# Altium schematic sheet POWER_SUPPLY_20V_4A.SchDoc
size A1
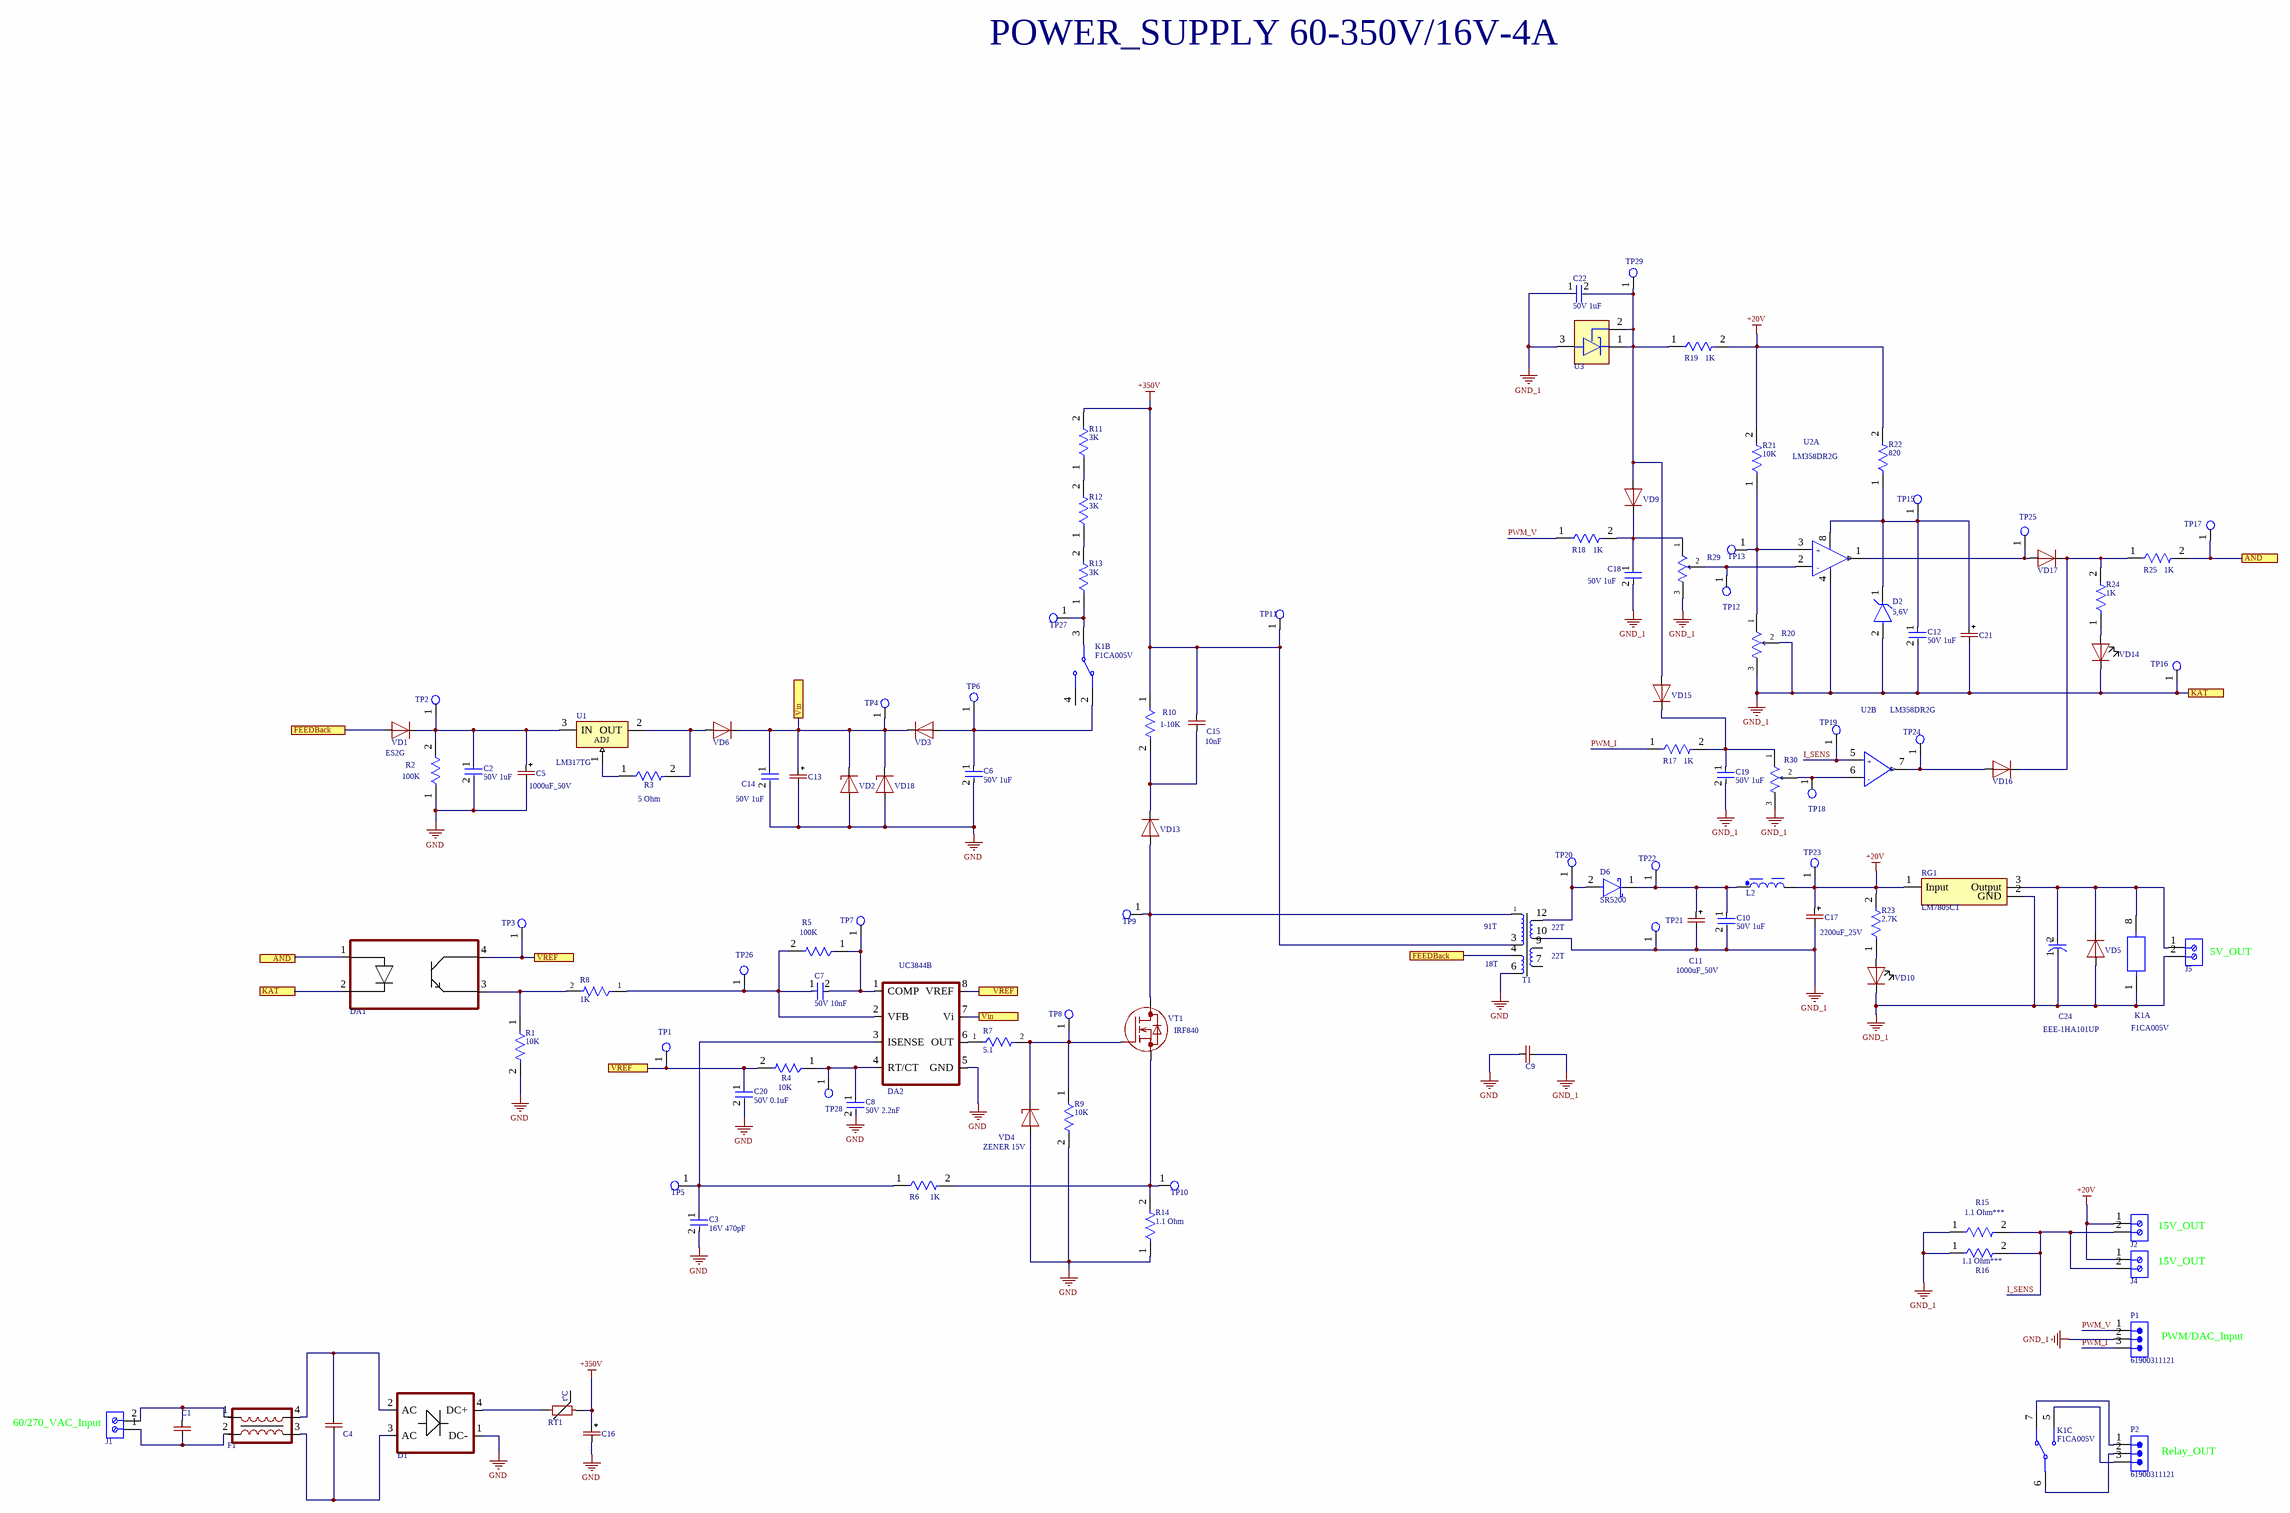
[diagram p0: POWER_SUPPLY_20V_4A.SchDoc]

## Parts
C1  CAP-NON-POLAR  [CAP-V15]  (value not drawn)
C2  50V 1uF  [FP-C0805C-DN-IPC_A]
C3  16V 470pF  [FP-C0805C-DN-IPC_A]
C4  CAP-NON-POLAR  [CAP-V15]  (value not drawn)
C5  1000uF_50V  [CAPPOL-12x25]
C6  50V 1uF  [FP-C0805C-DN-IPC_A]
C7  50V 10nF  [FP-C0805C-DN-IPC_A]
C8  50V 2.2nF  [FP-C0805C-DN-IPC_A]
C9  CAP-V  [CAP-V]  (value not drawn)
C10  50V 1uF  [FP-C0805C-DN-IPC_A]
C11  1000uF_50V  [CAPPOL-12x25]
C12  50V 1uF  [FP-C0805C-DN-IPC_A]
C13  CAP-POLAR  [CAPPOL-12x25]  (value not drawn)
C14  50V 1uF  [FP-C0805C-DN-IPC_A]
C15  10nF  [CAP-V]
C16  CAP-POLAR  [CAP 100uF_500V 22x40mm]  (value not drawn)
C17  2200uF_25V  [CAPPOL-12x25]
C18  50V 1uF  [FP-C0805C-DN-IPC_A]
C19  50V 1uF  [FP-C0805C-DN-IPC_A]
C20  50V 0.1uF  [FP-C0805C-DN-IPC_A]
C21  CAP-POLAR  [CAP-TAN-C]  (value not drawn)
C22  50V 1uF  [FP-C0805C-DN-IPC_A]
C24  EEE-1HA101UP  [FP-SF-MFG]
D1  RS40X  [RS40X]  (value not drawn)
D2  5,6V  [FP-SB-V-3906_04-031_4-MFG]
D6  SR5200  [SR5100(DO-201AD]
DA1  PC817  [4-SMD]  (value not drawn)
DA2  UC3844B  [SOIC8-150]
F1  FILTER  [FILTER_1]  (value not drawn)
J1  691101710002  [691101710002]  (value not drawn)
J2  (no value)  [691101710002]
J4  691101710002  [691101710002]  (value not drawn)
J5  691101710002  [691101710002]  (value not drawn)
K1  F1CA005V  [Relay_F1CA005V_Omron]  (parts A,B,C of 3)
L2  1.2µH, 7.4A  [WE-PD2_1054]  (value not drawn)
P1  61900311121  [61900311121]
P2  61900311121  [61900311121]
R1  10K  [RES-0805]
R2  100K  [RES-0805]
R3  5 Ohm  [RES-0805]
R4  10K  [RES-0805]
R5  100K  [RES-0805]
R6  1K  [RES-0805]
R7  5.1  [Vishay_CRCW0805-e3_IPC_A]
R8  1K  [Vishay_CRCW0805-e3_IPC_A]
R9  10K  [RES-0805]
R10  1-10K  [RES-2512]
R11  3K  [RES-2512]
R12  3K  [RES-2512]
R13  3K  [RES-2512]
R14  1.1 Ohm  [RES-2W]
R15  1.1 Ohm***  [RES-2W_2]
R16  1.1 Ohm***  [RES-2W_2]
R17  1K  [RES-0805]
R18  1K  [RES-0805]
R19  1K  [RES-0805]
R20  3296W-1-202LF  [Bourns_3296W_MFG]  (value not drawn)
R21  10K  [RES-0805]
R22  820  [RES-0805]
R23  2.7K  [RES-0805]
R24  1K  [RES-0805]
R25  1K  [RES-0805]
R29  3296W-1-202LF  [Bourns_3296W_MFG]  (value not drawn)
R30  3296W-1-202LF  [Bourns_3296W_MFG]  (value not drawn)
RG1  LM7805CT  [TO-220_Bended_Rad]
RT1  RES-TEMP  [RES-V5]  (value not drawn)
T1  ETD29  [ETD29_Transformer]  (value not drawn)
TP1  Test_Point_PCB  [Test_Point]  (value not drawn)
TP2  Test_Point_PCB  [Test_Point]  (value not drawn)
TP3  Test_Point_PCB  [Test_Point]  (value not drawn)
TP4  Test_Point_PCB  [Test_Point]  (value not drawn)
TP5  Test_Point_PCB  [Test_Point]  (value not drawn)
TP6  Test_Point_PCB  [Test_Point]  (value not drawn)
TP7  Test_Point_PCB  [Test_Point]  (value not drawn)
TP8  Test_Point_PCB  [Test_Point]  (value not drawn)
TP9  Test_Point_PCB  [Test_Point]  (value not drawn)
TP10  Test_Point_PCB  [Test_Point]  (value not drawn)
TP11  Test_Point_PCB  [Test_Point]  (value not drawn)
TP12  Test_Point_PCB  [Test_Point]  (value not drawn)
TP13  Test_Point_PCB  [Test_Point]  (value not drawn)
TP15  Test_Point_PCB  [Test_Point]  (value not drawn)
TP16  Test_Point_PCB  [Test_Point]  (value not drawn)
TP17  Test_Point_PCB  [Test_Point]  (value not drawn)
TP18  Test_Point_PCB  [Test_Point]  (value not drawn)
TP19  Test_Point_PCB  [Test_Point]  (value not drawn)
TP20  Test_Point_PCB  [Test_Point]  (value not drawn)
TP21  Test_Point_PCB  [Test_Point]  (value not drawn)
TP22  Test_Point_PCB  [Test_Point]  (value not drawn)
TP23  Test_Point_PCB  [Test_Point]  (value not drawn)
TP24  Test_Point_PCB  [Test_Point]  (value not drawn)
TP25  Test_Point_PCB  [Test_Point]  (value not drawn)
TP26  Test_Point_PCB  [Test_Point]  (value not drawn)
TP27  Test_Point_PCB  [Test_Point]  (value not drawn)
TP28  Test_Point_PCB  [Test_Point]  (value not drawn)
TP29  Test_Point_PCB  [Test_Point]  (value not drawn)
U1  LM317TG  [TO-220_Bended_Rad]
U2  LM358DR2G  [FP-751-07-IPC_C]  (parts A,B of 2)
U3  TL431  [TL431_SOT-23-3(MGF)]  (value not drawn)
VD1  ES2G  [DO-214AC, SMA]
VD2  ZENER  [DO-017AA]  (value not drawn)
VD3  DIODE  [DO-214AC, SMA]  (value not drawn)
VD4  ZENER 15V  [DO-017AA]
VD5  DIODE  [SOD-123]  (value not drawn)
VD6  DIODE  [DO-214AC, SMA]  (value not drawn)
VD9  DIODE  [SOD-123]  (value not drawn)
VD10  LED  [LED-0603]  (value not drawn)
VD13  DIODE  [DO-214AC, SMA]  (value not drawn)
VD14  LED  [LED-0603]  (value not drawn)
VD15  DIODE  [SOD-123]  (value not drawn)
VD16  DIODE  [SOD-123]  (value not drawn)
VD17  DIODE  [SOD-123]  (value not drawn)
VD18  ZENER  [DO-017AA]  (value not drawn)
VT1  IRF840  [TO-220_Bended_Rad]

## Ports
AND, FEEDBack, KAT, Vin, VREF

## Nets
+20V: C17.1(+) J2.1 J4.1 L2.2 R19.2 R21.2 R22.2 R23.2 RG1.1(Input) TP23.1(G9)
+350V: C15.2 C16.1(+) R10.1 R11.2 RT1.1 T1.3 TP11.1(G9)
GND: C2.2 C3.2 C5.2(-) C6.2 C8.2 C9.1 C13.2(-) C14.2 C16.2(-) C20.2 D1.1(DC-) DA2.5(GND) R1.2 R2.1 R9.2 R14.1 T1.6 VD2.2(A) VD4.2(A) VD18.2(A)
GND_1: C9.2 C10.2 C11.2(-) C12.2 C17.2(-) C18.2 C19.2 C21.2(-) C22.1 C24.1(C) D2.2(A) DA1.2(CATHODE) J5.2 K1.1 P1.2 R15.1 R16.1 R20.2(WIPER) R20.3(CW) R29.3(CW) R30.3(CW) RG1.2(GND) T1.10 TP16.1(G9) TP21.1(G9) U2.4(VEE/GND) U3.3(A) VD5.2(A) VD10.1(C) VD14.1(C) ; port KAT
AND: DA1.1(ANODE) R25.2 TP17.1(G9) ; port AND
FEEDBack: T1.4 VD1.2(A) ; port FEEDBack
I_SENS: J2.2 J4.2 R15.2 R16.2 TP19.1(G9) U2.5(INPUT_B+)
PWM_I: P1.3 R17.1
PWM_V: P1.1 R18.1
Vin: C13.1(+) C14.1 DA2.7(Vi) TP4.1(G9) VD2.1(C) VD3.1(C) VD6.1(C) VD18.1(C) ; port Vin
VREF: C20.1 DA1.4(COLLECTOR) DA2.8(VREF) R4.2 TP1.1(G9) TP3.1(G9) ; port VREF
NetC1_1: C1.1 F1.2 J1.1
NetC1_2: C1.2 F1.1 J1.2
NetC2_1: C2.1 C5.1(+) R2.2 TP2.1(G9) U1.3(IN) VD1.1(C)
NetC3_1: C3.1 DA2.3(ISENSE) R6.1 TP5.1(G9)
NetC4_1: C4.1 D1.3(AC) F1.3
NetC4_2: C4.2 D1.2(AC) F1.4
NetC6_1: C6.1 K1.2 TP6.1(G9) VD3.2(A)
NetC7_1: C7.1 DA2.2(VFB) R5.2 R8.1 TP26.1(G9)
NetC7_2: C7.2 DA2.1(COMP) R5.1 TP7.1(G9)
NetC8_1: C8.1 DA2.4(RT/CT) R4.1 TP28.1(G9)
NetC10_1: C10.1 C11.1(+) D6.1(C) L2.1 TP22.1(G9)
NetC12_1: C12.1 C21.1(+) D2.1(C) R22.1 TP15.1(G9) U2.8(VCC)
NetC15_1: C15.1 R10.2 VD13.1(C)
NetC18_1: C18.1 R18.2 R29.1(CCW) VD9.1(C)
NetC19_1: C19.1 R17.2 R30.1(CCW) VD15.1(C)
NetC22_2: C22.2 R19.1 TP29.1(G9) U3.1(C) U3.2(REF) VD9.2(A) VD15.2(A)
NetC24_2: C24.2(A) J5.1 K1.8 RG1.3(Output) VD5.1(C)
NetD1_4: D1.4(DC+) RT1.2
NetD6_2: D6.2(A) T1.12 TP20.1(G9)
NetDA1_3: DA1.3(EMITTER) R1.1 R8.2
NetDA2_6: DA2.6(OUT) R7.1
NetK1_3: K1.3 R13.1 TP27.1(G9)
NetK1_5: K1.5 P2.3
NetK1_6: K1.6 P2.2
NetK1_7: K1.7 P2.1
NetR3_1: R3.1 U1.1(ADJ)
NetR3_2: R3.2 U1.2(OUT) VD6.2(A)
NetR6_2: R6.2 R14.2 TP10.1(G9) VT1.3(S)
NetR7_2: R7.2 R9.1 TP8.1(G9) VD4.1(C) VT1.1(G)
NetR11_1: R11.1 R12.2
NetR12_1: R12.1 R13.2
NetR20_1: R20.1(CCW) R21.1 TP13.1(G9) U2.3(INPUT_A+)
NetR23_1: R23.1 VD10.2(A)
NetR24_1: R24.1 VD14.2(A)
NetR24_2: R24.2 R25.1 VD16.1(C) VD17.1(C)
NetR29_2: R29.2(WIPER) TP12.1(G9) U2.2(INPUT_A-)
NetR30_2: R30.2(WIPER) TP18.1(G9) U2.6(INPUT_B-)
NetT1_1: T1.1 TP9.1(G9) VD13.2(A) VT1.2(D)
NetTP24_1: TP24.1(G9) U2.7(OUTPUT_B) VD16.2(A)
NetTP25_1: TP25.1(G9) U2.1(OUTPUT_A) VD17.2(A)

Not connected (* = marked no-connect by the designer): K1 4; T1 7 9

## Notes on the sheet
- POWER_SUPPLY 60-350V/16V-4A
- (near T1) 91T
- (near T1) 22T
- (near T1) 18T
- (near J5) 5V_OUT
- 15V_OUT
- (near P1) PWM/DAC_Input
- (near J1) 60/270_VAC_Input
- (near P2) Relay_OUT
- (in symbol CMP-1310-00291-2, part A) +; -
- (in symbol CMP-1310-00291-2, part B) +; -
- (in symbol CMP-05427-000015-1) +
- (in symbol RES-TEMP) t°C

## Library data of the parts
C2 C3 C6 C7 C10 C12 C14 C18 C19 C22 = CMP-1036-04552-2: CAP CER 0.22UF 50V X7R 0805; Manufacturer: KEMET; Manufacturer Part Number: C0805C224K5RACTU; Value: 0.22 μF; Temperature Coefficient: 30ppm/°C; Material: Ceramic; Tolerance: 0.1; ComponentLink2URL: https://content.kemet.com/datasheets/KEM_C1003_C0G_SMD.pdf; Temperature Characteristic: X7R; Device Class L3: Ceramic Capacitors; Lead Free: Yes; Temperature: -55°C to +125°C; RoHS: TRUE; Capacitance: 0.22 μF; Automotive: No; Octopart: https://octopart.com/c0805c224k5ractu-kemet-144670; Temperature Range Low: -55°C; Height: 0.88mm; Device Class L1: Passive Components; Digikey Description: CAP CER 0.22UF 50V X7R 0805; ComponentLink2Description: Datasheet; Mouser Description: CAP CER 0.22UF 50V X7R 0805; Category: Cap; Ipc Land Pattern Name: CAPC200125X78; Temperature Range High: +125°C; Package: C0805C-DN; Device Class L2: Capacitors; Voltage Rating: 50 V
C5 = CAP-POLAR: 1000uF_50V  12x25(13x26mm)
C8 = CMP-1036-04552-2: CAP CER 2.2nF 50V X7R 0805; Manufacturer: KEMET; Manufacturer Part Number: C0805C224K5RACTU; Value: 0.22 μF; Temperature Coefficient: 30ppm/°C; Material: Ceramic; Tolerance: 0.1; ComponentLink2URL: https://content.kemet.com/datasheets/KEM_C1003_C0G_SMD.pdf; Temperature Characteristic: X7R; Device Class L3: Ceramic Capacitors; Lead Free: Yes; Temperature: -55°C to +125°C; RoHS: TRUE; Capacitance: 0.22 μF; Automotive: No; Octopart: https://octopart.com/c0805c224k5ractu-kemet-144670; Temperature Range Low: -55°C; Height: 0.88mm; Device Class L1: Passive Components; Digikey Description: CAP CER 0.22UF 50V X7R 0805; ComponentLink2Description: Datasheet; Mouser Description: CAP CER 0.22UF 50V X7R 0805; Category: Cap; Ipc Land Pattern Name: CAPC200125X78; Temperature Range High: +125°C; Package: C0805C-DN; Device Class L2: Capacitors; Voltage Rating: 50 V
C11 C17 = CAP-POLAR
C15 = CAP-V
C20 = CMP-1036-04552-2: CAP CER 0.1UF 50V X7R 0805; Manufacturer: KEMET; Manufacturer Part Number: C0805C224K5RACTU; Value: 0.22 μF; Temperature Coefficient: 30ppm/°C; Material: Ceramic; Tolerance: 0.1; ComponentLink2URL: https://content.kemet.com/datasheets/KEM_C1003_C0G_SMD.pdf; Temperature Characteristic: X7R; Device Class L3: Ceramic Capacitors; Lead Free: Yes; Temperature: -55°C to +125°C; RoHS: TRUE; Capacitance: 0.22 μF; Automotive: No; Octopart: https://octopart.com/c0805c224k5ractu-kemet-144670; Temperature Range Low: -55°C; Height: 0.88mm; Device Class L1: Passive Components; Digikey Description: CAP CER 0.22UF 50V X7R 0805; ComponentLink2Description: Datasheet; Mouser Description: CAP CER 0.22UF 50V X7R 0805; Category: Cap; Ipc Land Pattern Name: CAPC200125X78; Temperature Range High: +125°C; Package: C0805C-DN; Device Class L2: Capacitors; Voltage Rating: 50 V
C24 = CMP-05427-000015-1: CAP ALUM 100UF 20% 50V SMD; Manufacturer: Panasonic; Automotive Grade: Grade 3; Leakage Current: 100uA; Dissipation Factor: 0.12%; Life: 2000Hours; Ripple Current: 200mA; Material: Aluminum; ComponentLink2Description: Datasheet; Category: Cap; Voltage Rating: 50V; Value: 100uF; Octopart: https://octopart.com/eee-1ha101up-panasonic-55396734; Digikey Description: CAP ALUM 100UF 20% 50V SMD; Package: SF; RoHS: TRUE; Height: 10.5mm; ComponentLink2URL: https://industrial.panasonic.com/cdbs/www-data/pdf/RDE0000/ABA0000C1145.pdf; Tolerance: 20%; Mouser Description: Cap Aluminum Lytic 100uF 50V 20% (8 X 10.2mm) SMD 200mA 2000h 85C Automotive T/R; Device Class L2: Capacitors; Temperature Range High: +85°C; Lead Free: Yes; Device Class L3: Aluminum Electrolytic Capacitors; Device Class L1: Passive Components; Manufacturer Part Number: EEE-1HA101UP; Temperature: -40°C to +85°C; Automotive: Yes; Capacitance: 100uF; Voltage: 50V; Temperature Range Low: -40°C
D2 = CMP-02541-000026-1: DIODE ZENER 8.2V 500MW DO35; Test Current: 5mA; Tolerance: 2%; Impedance: 7R; ESD Protection: No; Element Configuration: Single; Max Reverse Leakage Current: 100nA; Packaging: Ammo Pack; Case/Package: DO-35; Lead Free: Lead Free; Number of Pins: 2; Min Operating Temperature: -65°C; Contact Plating: Tin; Max Power Dissipation: 500mW; Radiation Hardening: No; Max Operating Temperature: 175°C; Mount: Through Hole; Package Quantity: 30000; Voltage Tolerance: 2%; Series: Automotive, AEC-Q101; Zener Voltage: 8.2V; RoHS Compliant: Yes; Power Dissipation: 500mW
D6 = SR5100
DA2 = UC3842B
J1 J2 J4 J5 = 691101710002: WR-TBL Series 101 Horizontal Entry Modular, THT, pitch 5mm, 2p; Manufacturer: Wurth Elektronik; Modularity: Yes; Rated Current: 16A; Working Voltage: 250V; ComponentLink1Description: Website Link; ComponentLink1URL: https://www.we-online.com/redexpert/article/691101710002?ad; ComponentLink2Description: Datasheet Link; ComponentLink2URL: https://www.we-online.com/redexpert/spec/691101710002?ad; Manufacturer Part Number: 691101710002; Category: Terminal Blocks; Match Code: WR-TBL; Mount: Through Hole; Operating Temperature Max: 105°C; Operating Temperature Min: -40°C; Packaging: Box; Application: Pressure Clamp; Number of Pins: 2; Number of Rows: 1; Orientation: Horizontal; Pitch: 5mm
L2 = 744776012: WE-PD2 SMT Power Inductor, size 1054, 1.2µH, 7.4A, 0.006Ω; Manufacturer: Wurth Elektronik; Case/Size Code: 1054; DC Resistance: 0.004Ω; Saturation Current: 11A; Self Resonant Frequency: 110MHz; Manufacturer Part Number: 744776012; Category: Unshielded Power Inductors; Match Code: WE-PD2; ComponentLink1Description: Website Link; ComponentLink1URL: https://www.we-online.com/redexpert/article/744776012?ad; ComponentLink2Description: Datasheet Link; ComponentLink2URL: https://www.we-online.com/redexpert/spec/744776012?ad; Mount: Surface Mount; Operating Temperature Max: 125°C; Operating Temperature Min: -40°C; Packaging: Tape and Reel; Length: 10mm; Width: 9mm; Height: 5.4mm; DC Resistance Max: 0.006Ω; Inductance: 1.2µH; Rated Current: 7.4A
P1 P2 = 61900311121: WR-WTB THT Male Vertical Locking Header, pitch 2.54mm, 3pins; Manufacturer: Wurth Elektronik; Contact Resistance: 20mΩ; Rated Current: 3A; Withstanding Voltage: 1000VAC; Working Voltage: 250VAC; ComponentLink1Description: Website Link; ComponentLink1URL: https://www.we-online.com/redexpert/article/61900311121?ad; ComponentLink2Description: Datasheet Link; ComponentLink2URL: https://www.we-online.com/redexpert/spec/61900311121?ad; Pitch: 2.54mm; Packaging: Bag; Gender: Male; Manufacturer Part Number: 61900311121; Category: Wire-to-Board Connectors; Match Code: WR-WTB; Mount: Through Hole; Operating Temperature Max: 105°C; Operating Temperature Min: -40°C; Length: 7.62mm; Width: 5.8mm; Height: 11.5mm; Number of Pins: 3; Number of Rows: 1; Orientation: Vertical
R1-R6 R9 R11-R14 R17-R19 R21-R25 = RES-CONST
R7 R8 = CRCW08050000Z0EA: 100k: *
R10 R15 R16 = RES-CONST: 10K
RG1 = LM7805CT: REG IC REG LINEAR 5V 1A TO220AB; Manufacturer: Fairchild; Voltage Dropout (Max): 2V @ 1A (Typ); Voltage - Input (Max): 35V; helpURL: https://upverter.com/upn/revision/b27a7358b7dd93a3/; ComponentLink2Description: Datasheet; Temperature: -40°C to +125°C; Package: TO220; Supplier 2: Mouser; Price: 0.384521982769; Supplier 1: Digi-Key; ComponentLink1URL: https://upverter.com/upn/revision/b27a7358b7dd93a3/; Supplier Part Number 2: 512-LM7805CT; Supplier Part Number 1: LM7805CT-ND; ComponentLink1Description: Upverter; ComponentLink2URL: https://www.fairchildsemi.com/datasheets/LM/LM7805.pdf; RoHS: TRUE; Mouser Part Number: 512-LM7805CT; Ipc Land Pattern Name: TO-220; Temperature Range High: +125°C; Digikey Description: REG IC REG LINEAR 5V 1A TO220AB; Digikey Part Number: LM7805CT-ND; Lead Free: yes; Temperature Range Low: -40°C; Voltage - Output: 5V; Current-Output: 1A; Part Number: LM7805CT
T1 = Trans_ETD59
TP1-TP13 TP15-TP29 = TP_PCB?: Test_Point
U2 = CMP-1310-00291-2: IC OPAMP GP 2 CIRCUIT 8SOIC; Gain Bandwidth Product: 1MHz; Number of Circuits: 2; Min Supply Voltage: 3V; Slew Rate: 0.6V/µs; Max Dual Supply Voltage: 16V; Common Mode Rejection Ratio: 65dB; Input Bias Current: 250nA; Min Dual Supply Voltage: 1.5V; Dual Supply Voltage: 9V; Operating Supply Current: 1.5mA; Output Current: 40mA; Input Offset Voltage (Vos): 7mV; Nominal Supply Current: 1.2mA; Voltage Gain: 100dB; Max Supply Voltage: 32V; Width: 4mm; Number of Pins: 8; Min Operating Temperature: 0°C; REACH SVHC: No SVHC; Contact Plating: Tin; Lead Free: Lead Free; Halogen Free: Halogen Free; Power Supply Rejection Ratio (PSRR): 65dB; Operating Supply Voltage: 16V; Package Quantity: 2500; Max Operating Temperature: 70°C; Case/Package: SOIC; Height: 1.5mm; Packaging: Tape and Reel; Radiation Hardening: No; Number of Channels: 2; Bandwidth: 1MHz; Length: 5mm; Number of Elements: 2; Number of Amplifiers: 2; Output Current per Channel: 40mA
U3 = TL431_SOT-23-3
VD1 = DIODE
VD4 = ZENER
VT1 = MOSFET-N-GDS